# Altium schematic sheet Power supply.SchDoc (part 1 of 6)
size 558 x 431 mm; SheetNumber: 1; SheetTotal: 3
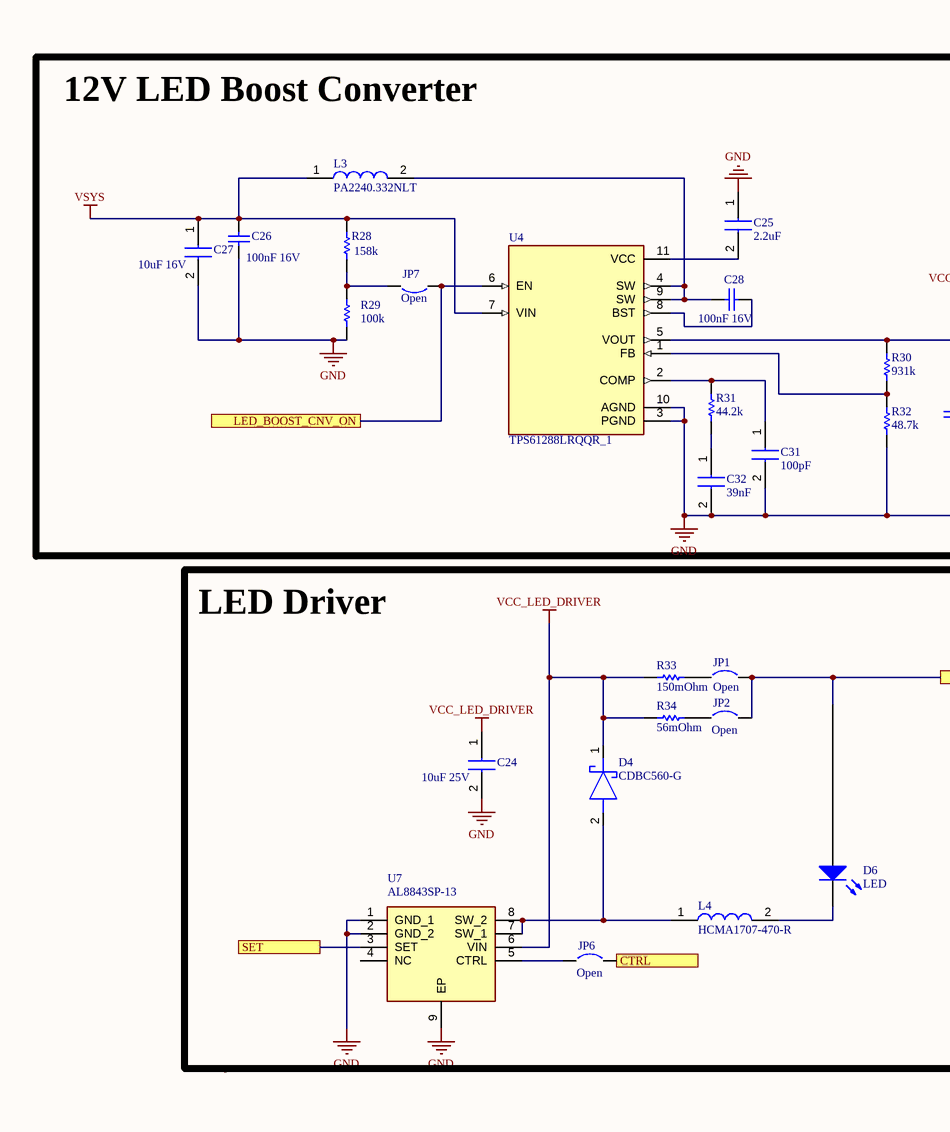
[diagram p0: Power supply.SchDoc, left]
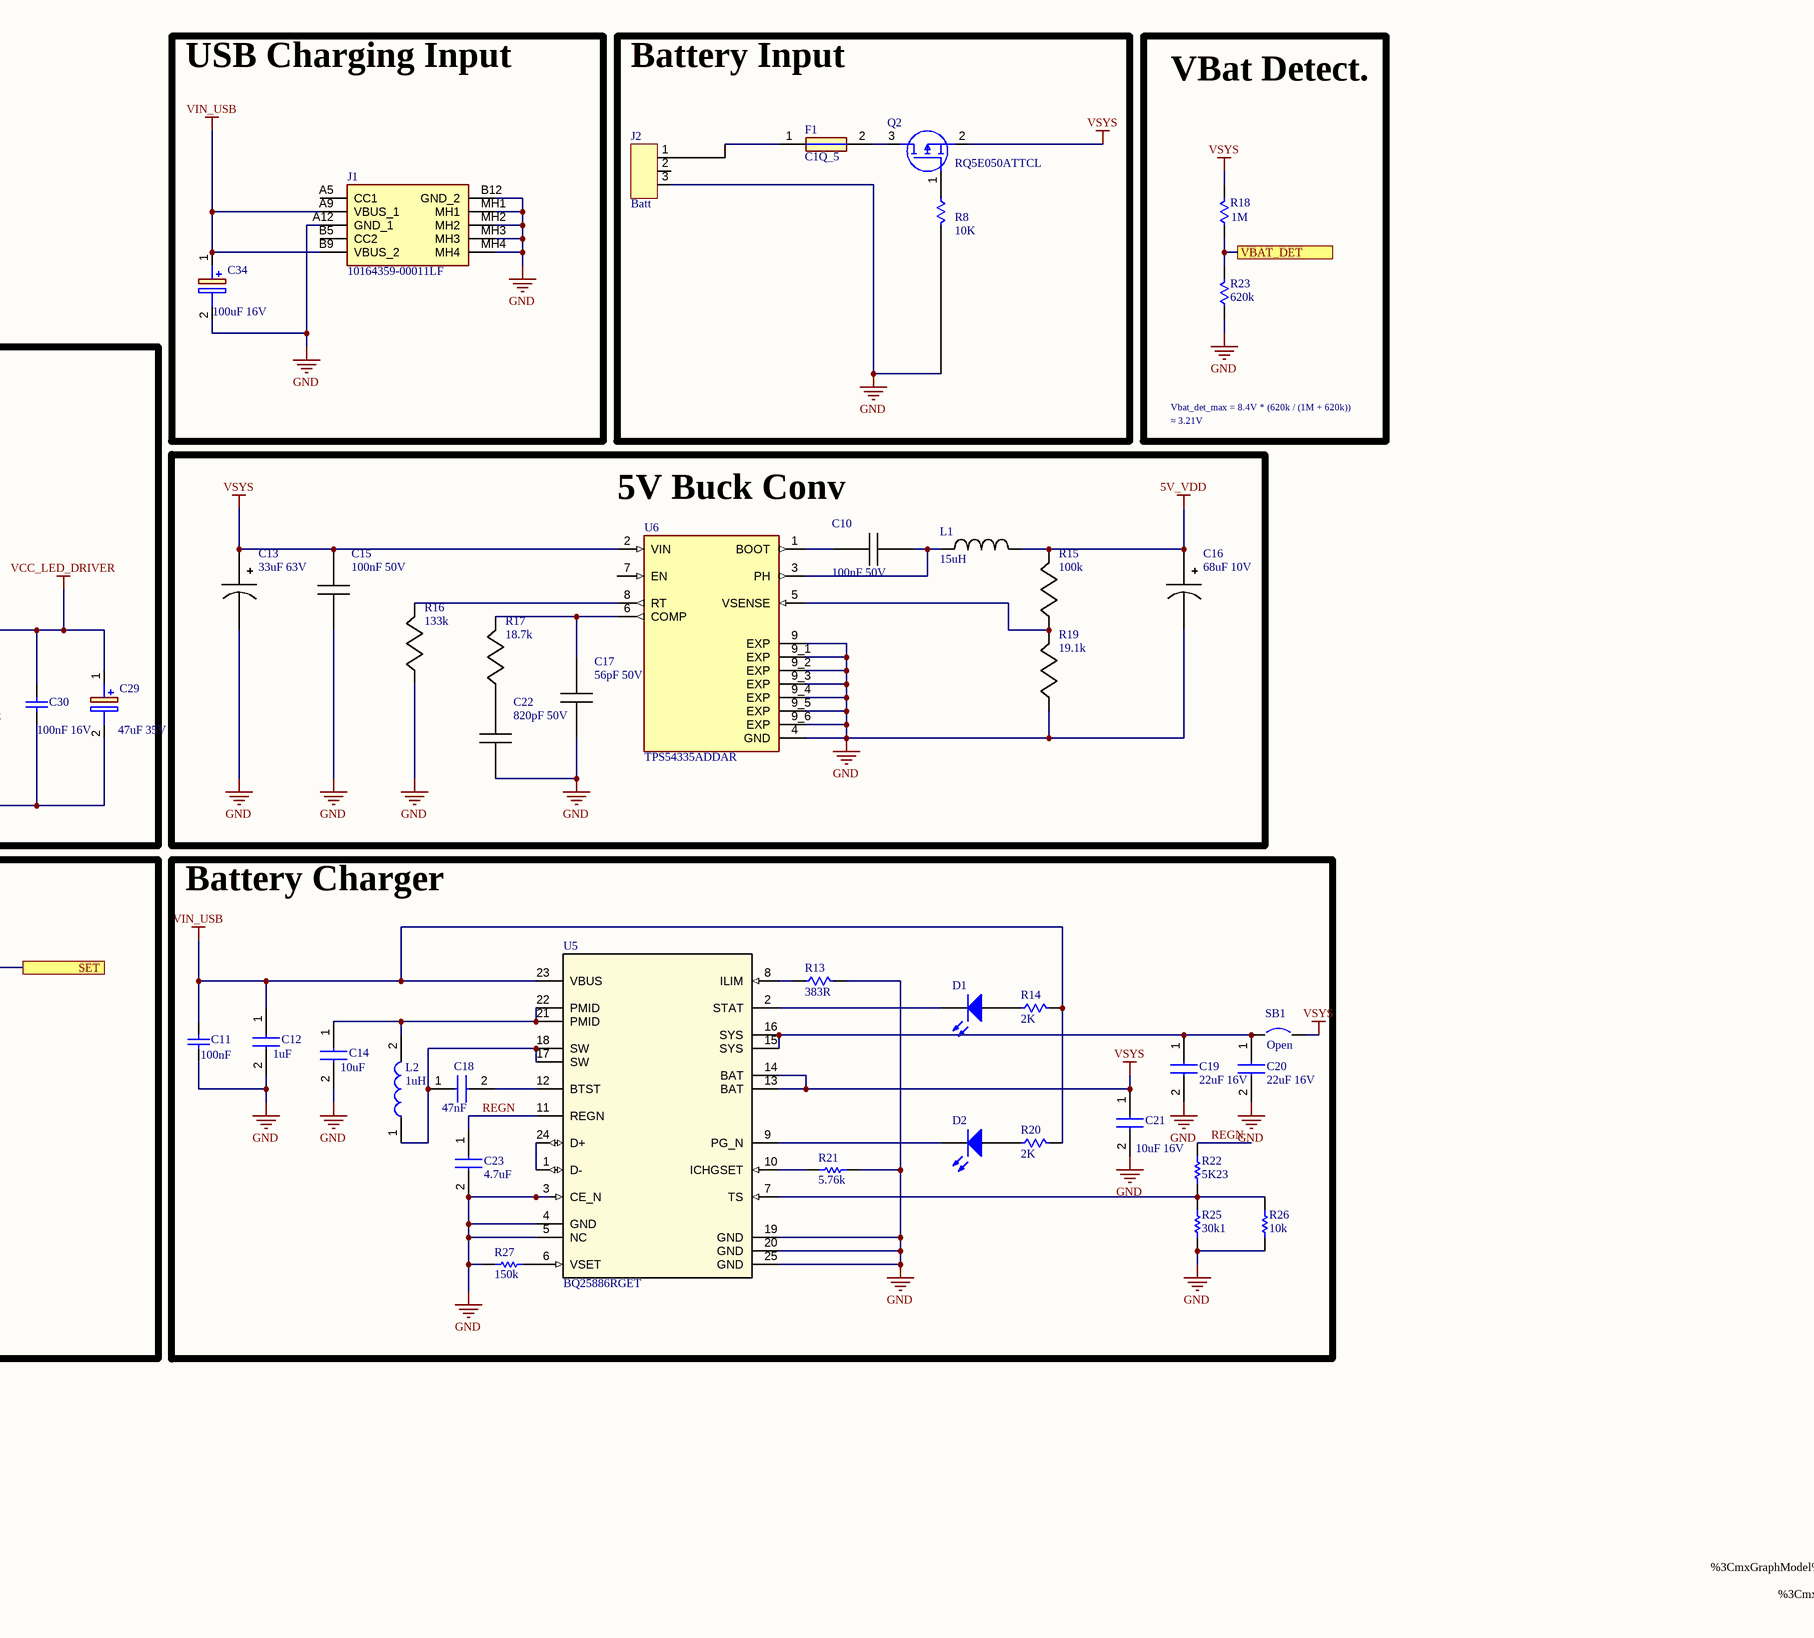
[diagram p1: Power supply.SchDoc, right]

## Parts
C10  100nF 50V  [0805C]
C11  100nF  [C0603]
C12  1uF  [C0805]
C13  33uF 63V  [SM_RADIAL_8MM]
C14  10uF  [C0603]
C15  100nF 50V  [0805C]
C16  68uF 10V  [SM_RADIAL_5MM]
C17  56pF 50V  [0805C]
C18  47nF  [C0805]
C19  22uF 16V  [C0603]
C20  22uF 16V  [C0603]
C21  10uF 16V  [C0603]
C22  820pF 50V  [0402]
C23  4.7uF  [C0805]
C24  10uF 25V  [0805C]
C25  2.2uF  [0805C]
C26  100nF 16V  [C0603]
C27  10uF 16V  [C0603]
C28  100nF 16V  [C0603]
C29  47uF 35V  [CAPAE660X550N]
C30  100nF 16V  [C0603]
C31  100pF  [C0603]
C32  39nF  [C0603]
C34  100uF 16V  [CAPAE660X770N]
D1  LED3  [C0603]  (value not drawn)
D2  LED3  [C0603]  (value not drawn)
D4  CDBC560-G  [DIOM7959X262N]
D6  LED  [SolderWires]
F1  C1Q_5  [FUSC3216X78N]
J1  10164359-00011LF  [1016435900011LF]
J2  Batt  [Batt]
JP1  Open  [HDRV2W87P0X254_1X2_768X249X1494P - duplicate]
JP2  Open  [HDRV2W87P0X254_1X2_768X249X1494P - duplicate]
JP6  Open  [HDRV2W87P0X254_1X2_768X249X1494P - duplicate]
JP7  Open  [HDRV2W87P0X254_1X2_768X249X1494P - duplicate]
L1  15uH  [SRR1280]
L2  1uH  [VLS5045EX330M]
L3  PA2240.332NLT  [PA2240332NLT]
L4  HCMA1707-470-R  [INDPM172168X700N]
Q2  RQ5E050ATTCL  [SOT95P280X100-3N]
R8  10K  [0603]
R13  383R  [R0603]
R14  2K  [R0603]
R15  100k  [0402]
R16  133k  [0201]
R17  18.7k  [0201]
R18  1M  [0603]
R19  19.1k  [0402]
R20  2K  [R0603]
R21  5.76k  [R0603]  (no BOM)
R22  5K23  [R0603]  (no BOM)
R23  620k  [0603]
R25  30k1  [R0603]  (no BOM)
R26  10k  [R0603]  (no BOM)
R27  150k  [R0603]  (no BOM)
R28  158k  [0603]
R29  100k  [R0603]
R30  931k  [R0603]
R31  44.2k  [R0603]
R32  48.7k  [R0603]
R33  150mOhm  [R0603]
R34  56mOhm  [R0603]
SB1  Open  [SB_0603]
U4  TPS61288LRQQR_1  [CONV_TPS61288LRQQR]
U5  BQ25886RGET  [RGE0024H]
U6  TPS54335ADDAR  [IC_TPS54335ADDAR]
U7  AL8843SP-13  [SOIC127P600X163-9N]

## Blocks framed on the sheet
USB Charging Input: C34 J1
Battery Input: F1 J2 Q2 R8
VBat Detect.: R18 R23
12V LED Boost Converter: C25-C32 JP7 L3 R28-R32 U4
5V Buck Conv: C10 C13 C15-C17 C22 L1 R15-R17 R19 U6
LED Driver: C24 D4 D6 JP1 JP2 JP6 L4 R33 R34 U7
Battery Charger: C11 C12 C14 C18-C21 C23 D1 D2 L2 R13 R14 R20-R22 R25-R27 SB1 U5

## Ports
CTRL, LED_BOOST_CNV_ON, SET, VBAT_DET

## Nets
5V_VDD: C16.1(+) L1.2 R15.1
GND: C11.1 C12.2 C13.2(-) C14.2 C15.1 C16.2(-) C17.2 C19.2 C20.2 C21.2 C22.2 C23.2 C24.2 C25.1 C26.1 C27.2 C29.2(-) C30.1 C31.2 C32.2 C34.2(-) J1.A12(GND_1) J1.B12(GND_2) J1.MH1 J1.MH2 J1.MH3 J1.MH4 J2.3 R8.2 R13.2 R16.2 R19.2 R21.2 R23.1 R25.2 R26.2 R27.1 R29.1 R32.1 U4.3(PGND) U4.10(AGND) U5.3(CE_N) U5.4(GND) U5.5(NC) U5.19(GND) U5.20(GND) U5.25(GND) U6.4(GND) U6.9(EXP) U6.9_1(EXP) U6.9_2(EXP) U6.9_3(EXP) U6.9_4(EXP) U6.9_5(EXP) U6.9_6(EXP) U7.1(GND_1) U7.2(GND_2) U7.9(EP)
VCC_LED_DRIVER: C24.1 C29.1(+) C30.2 D4.1(K) R30.2 R33.2 R34.2 U4.5(VOUT) U7.6(VIN)
VIN_USB: C11.2 C12.1 C34.1(+) J1.A9(VBUS_1) J1.B9(VBUS_2) R14.2 R20.2 U5.23(VBUS)
VSYS: C13.1(+) C15.2 C21.1 C26.2 C27.1 L3.1 Q2.2(S) R18.2 R28.2 SB1.2 U4.7(VIN) U5.13(BAT) U5.14(BAT) U6.2(VIN)
CTRL: JP6.2 ; port CTRL
LED_BOOST_CNV_ON: JP7.1 U4.6(EN) ; port LED_BOOST_CNV_ON
REGN: C23.1 R22.1 U5.11(REGN)
SET: D6.1(A) JP1.2 JP2.2 U7.3(SET) ; port SET
VBAT_DET: R18.1 R23.2 ; port VBAT_DET
NetC10_1: C10.1 U6.1(BOOT)
NetC10_2: C10.2 L1.1 U6.3(PH)
NetC14_1: C14.1 L2.2 U5.21(PMID) U5.22(PMID)
NetC17_1: C17.1 R17.1 U6.6(COMP)
NetC18_1: C18.1 L2.1 U5.17(SW) U5.18(SW)
NetC18_2: C18.2 U5.12(BTST)
NetC19_1: C19.1 C20.1 SB1.1 U5.15(SYS) U5.16(SYS)
NetC22_1: C22.1 R17.2
NetC25_2: C25.2 U4.11(VCC)
NetC28_1: C28.1 U4.8(BST)
NetC28_2: C28.2 L3.2 U4.4(SW) U4.9(SW)
NetC31_1: C31.1 R31.2 U4.2(COMP)
NetC32_1: C32.1 R31.1
NetD1_1: D1.1(A) R14.1
NetD1_2: D1.2(K) U5.2(STAT)
NetD2_1: D2.1(A) R20.1
NetD2_2: D2.2(K) U5.9(PG_N)
NetD4_2: D4.2(A) L4.1 U7.7(SW_1) U7.8(SW_2)
NetD6_2: D6.2(K) L4.2
NetF1_1: F1.1 J2.1
NetF1_2: F1.2 Q2.3(D)
NetJP1_1: JP1.1 R33.1
NetJP2_1: JP2.1 R34.1
NetJP6_1: JP6.1 U7.5(CTRL)
NetJP7_2: JP7.2 R28.1 R29.2
NetQ2_1: Q2.1(G) R8.1
NetR13_1: R13.1 U5.8(ILIM)
NetR15_2: R15.2 R19.1 U6.5(VSENSE)
NetR16_1: R16.1 U6.8(RT)
NetR21_1: R21.1 U5.10(ICHGSET)
NetR22_2: R22.2 R25.1 R26.1 U5.7(TS)
NetR27_2: R27.2 U5.6(VSET)
NetR30_1: R30.1 R32.2 U4.1(FB)
NetU5_1: U5.1(D-) U5.24(D+)

Not connected (* = marked no-connect by the designer): J1 A5(CC1) B5(CC2); J2 2; U6 7(EN); U7 4(NC)
## Notes on the sheet
- Vbat_det_max = 8.4V * (620k / (1M + 620k))
- ≈ 3.21V